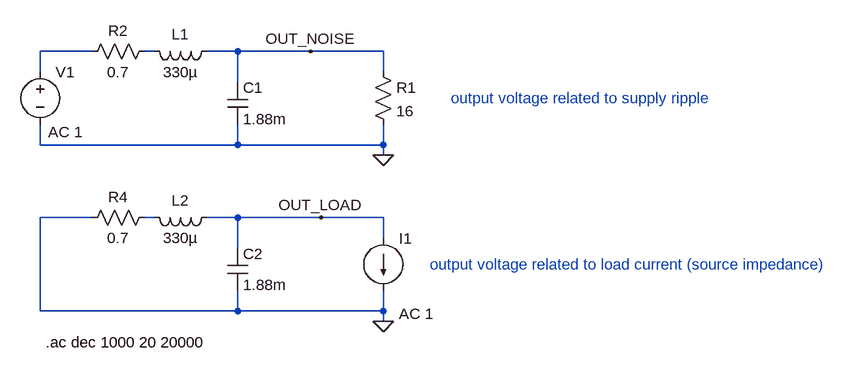
[diagram p0: schematic supply_filter.asc]
supply_filter.asc, the LTspice schematic file:
Version 4
SHEET 1 1268 680
WIRE 0 96 -80 96
WIRE 96 96 80 96
WIRE 224 96 176 96
WIRE 336 96 224 96
WIRE 448 96 336 96
WIRE -80 128 -80 96
WIRE 448 128 448 96
WIRE 224 144 224 96
WIRE -80 240 -80 208
WIRE 224 240 224 208
WIRE 224 240 -80 240
WIRE 448 240 448 208
WIRE 448 240 224 240
WIRE 448 256 448 240
WIRE 0 352 -80 352
WIRE 96 352 80 352
WIRE 224 352 176 352
WIRE 352 352 224 352
WIRE 448 352 352 352
WIRE 448 384 448 352
WIRE 224 400 224 352
WIRE -80 496 -80 352
WIRE 224 496 224 464
WIRE 224 496 -80 496
WIRE 448 496 448 464
WIRE 448 496 224 496
WIRE 448 512 448 496
FLAG 448 256 0
FLAG 336 96 OUT_NOISE
FLAG 448 512 0
FLAG 352 352 OUT_LOAD
SYMBOL ind 192 80 R90
WINDOW 0 5 56 VBottom 2
WINDOW 3 32 56 VTop 2
SYMATTR InstName L1
SYMATTR Value 330µ
SYMBOL cap 208 144 R0
SYMATTR InstName C1
SYMATTR Value 1.88m
SYMBOL res 432 112 R0
SYMATTR InstName R1
SYMATTR Value 16
SYMBOL voltage -80 112 R0
WINDOW 123 12 108 Left 2
WINDOW 39 0 0 Left 2
SYMATTR Value2 AC 1
SYMATTR InstName V1
SYMATTR Value ""
SYMBOL res 96 80 R90
WINDOW 0 0 56 VBottom 2
WINDOW 3 32 56 VTop 2
SYMATTR InstName R2
SYMATTR Value 0.7
SYMBOL ind 192 336 R90
WINDOW 0 5 56 VBottom 2
WINDOW 3 32 56 VTop 2
SYMATTR InstName L2
SYMATTR Value 330µ
SYMBOL cap 208 400 R0
SYMATTR InstName C2
SYMATTR Value 1.88m
SYMBOL res 96 336 R90
WINDOW 0 0 56 VBottom 2
WINDOW 3 32 56 VTop 2
SYMATTR InstName R4
SYMATTR Value 0.7
SYMBOL current 448 384 R0
WINDOW 123 24 116 Left 2
WINDOW 39 0 0 Left 2
SYMATTR Value2 AC 1
SYMATTR InstName I1
SYMATTR Value ""
TEXT -72 544 Left 2 !.ac dec 1000 20 20000
TEXT 552 168 Left 2 ;output voltage related to supply ripple
TEXT 520 424 Left 2 ;output voltage related to load current (source impedance)

The netlist it stands for:
* supply_filter.asc
L1 OUT_NOISE N002 330µ
C1 OUT_NOISE 0 1.88m
R1 OUT_NOISE 0 16
V1 N001 0 AC 1
R2 N002 N001 0.7
L2 OUT_LOAD N003 330µ
C2 OUT_LOAD 0 1.88m
R4 N003 0 0.7
I1 OUT_LOAD 0 AC 1
.ac dec 1000 20 20000
* output voltage related to supply ripple
* output voltage related to load current (source impedance)
.backanno
.end

* Results of the author's LTspice run, read from the files saved beside the schematic
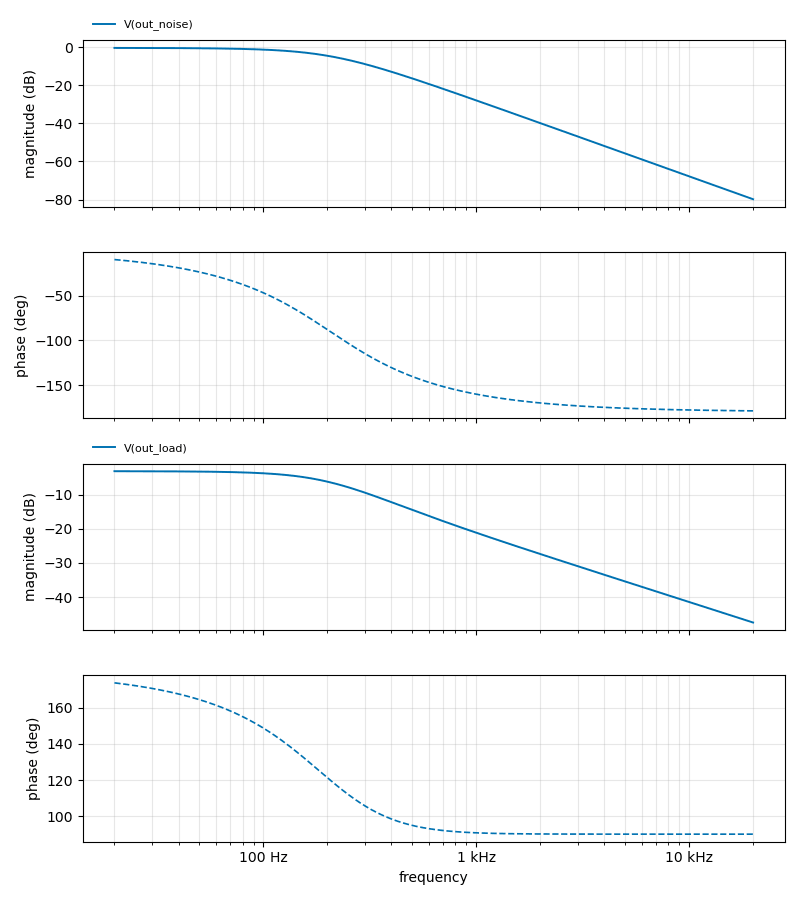
[diagram p1: AC Analysis of supply_filter.asc, plotted from the saved traces]
* AC Analysis, 1 run:
*   V(out_noise): -0.40 dB at 20 Hz, -79.82 dB at 20 kHz, peak -0.40 dB at 20 Hz, 3 dB below the peak at 172 Hz
*   V(out_load): -3.10 dB at 20 Hz, -47.47 dB at 20 kHz, peak -3.10 dB at 20 Hz, 3 dB below the peak at 198.4 Hz